# EAGLE schematic Neuro (EAGLE 8.6.0)
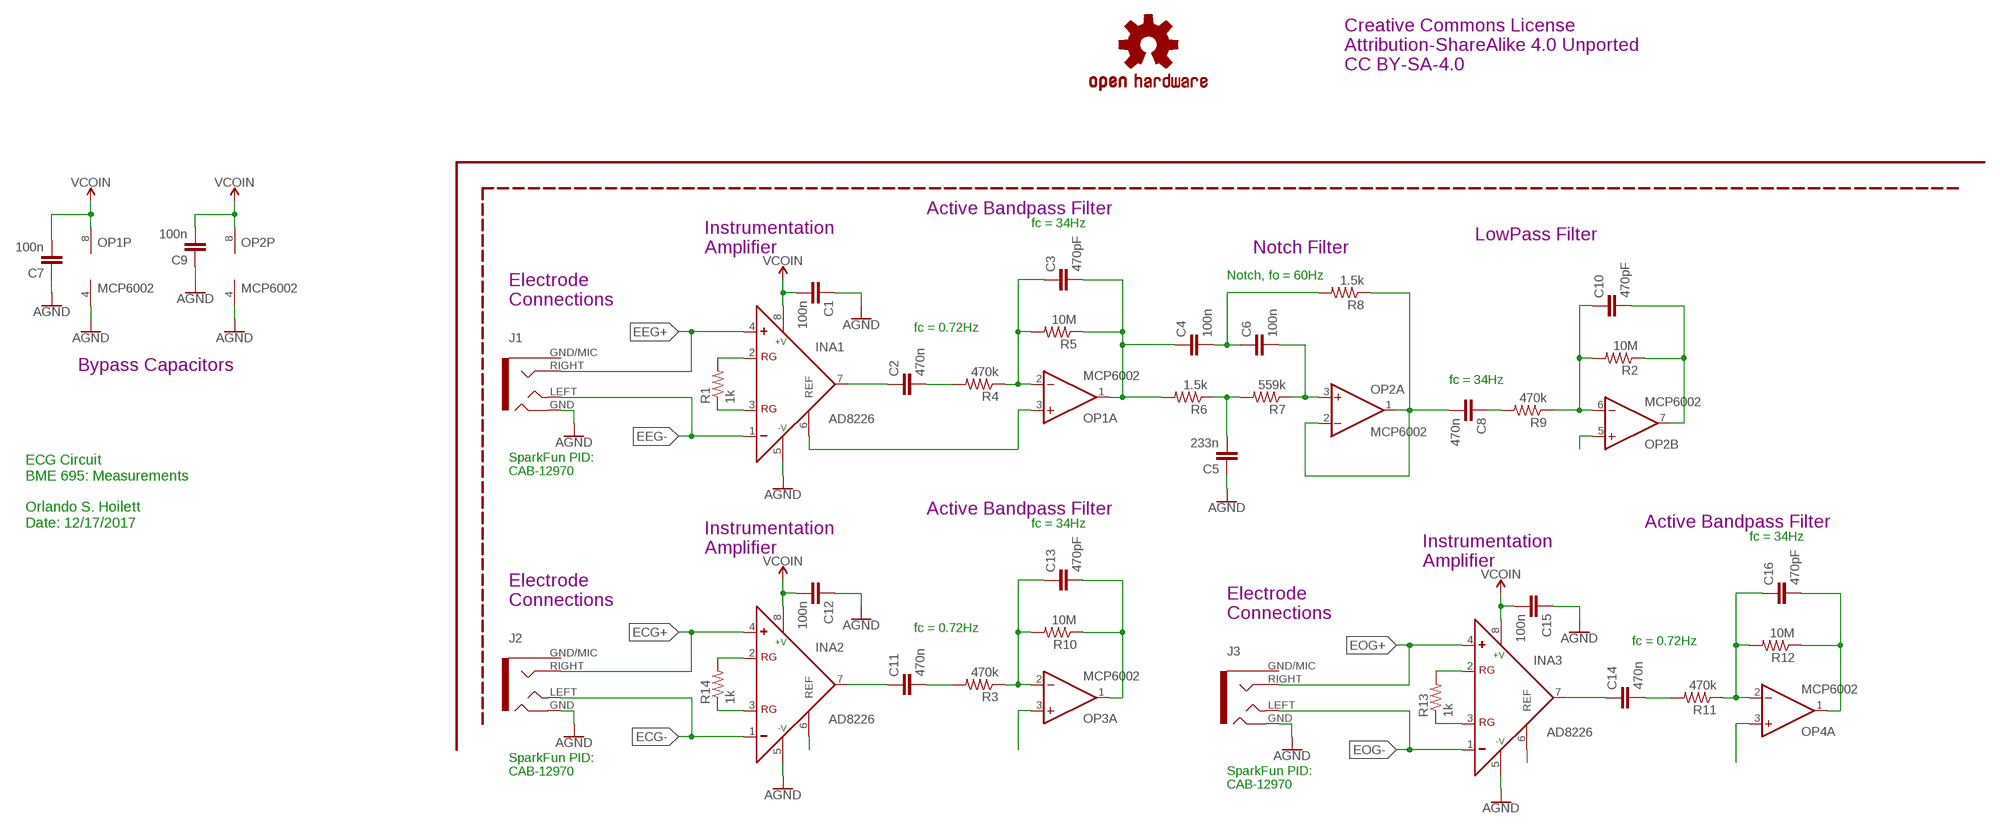
[diagram p0: schematic, sheet 1]

## Parts
C1  100n  CAPACITOR0402  [C0402]
C2  470n  CAPACITOR0402  [C0402]
C3  470pF  CAPACITOR0402  [C0402]
C4  100n  CAPACITOR0402  [C0402]
C5  233n  CAPACITOR0402  [C0402]
C6  100n  CAPACITOR0402  [C0402]
C7  100n  CAPACITOR0402  [C0402]
C8  470n  CAPACITOR0402  [C0402]
C9  100n  CAPACITOR0402  [C0402]
C10  470pF  CAPACITOR0402  [C0402]
C11  470n  CAPACITOR0402  [C0402]
C12  100n  CAPACITOR0402  [C0402]
C13  470pF  CAPACITOR0402  [C0402]
C14  470n  CAPACITOR0402  [C0402]
C15  100n  CAPACITOR0402  [C0402]
C16  470pF  CAPACITOR0402  [C0402]
INA1  AD8226  INA-A  [MSOP08]
INA2  AD8226  INA-A  [MSOP08]
INA3  AD8226  INA-A  [MSOP08]
J1  AUDIO_JACK_TRRSSMD_RA  [AUDIO_JACK_3.5MM_TRRS_SMD_RA]
J2  AUDIO_JACK_TRRSSMD_RA  [AUDIO_JACK_3.5MM_TRRS_SMD_RA]
J3  AUDIO_JACK_TRRSSMD_RA  [AUDIO_JACK_3.5MM_TRRS_SMD_RA]
LOGO1  OSHW-LOGOS  [OSHW-LOGO-S]
OP1  MCP6002  OP-DUALRM  [MSOP08]
OP2  MCP6002  OP-DUALRM  [MSOP08]
OP3  MCP6002  OP-DUALRM  [MSOP08]
OP4  MCP6002  OP-DUALRM  [MSOP08]
R1  1k  RESISTOR0402  [R0402]
R2  10M  RESISTOR0402  [R0402]
R3  470k  RESISTOR0402  [R0402]
R4  470k  RESISTOR0402  [R0402]
R5  10M  RESISTOR0402  [R0402]
R6  1.5k  RESISTOR0402  [R0402]
R7  559k  RESISTOR0402  [R0402]
R8  1.5k  RESISTOR0402  [R0402]
R9  470k  RESISTOR0402  [R0402]
R10  10M  RESISTOR0402  [R0402]
R11  470k  RESISTOR0402  [R0402]
R12  10M  RESISTOR0402  [R0402]
R13  1k  RESISTOR0402  [R0402]
R14  1k  RESISTOR0402  [R0402]

## Nets
AGND: C1.1 C5.1 C7.1 C9.1 C12.1 C15.1 INA1.5(-V) INA2.5(-V) INA3.5(-V) J1.GND(RING2) J2.GND(RING2) J3.GND(RING2) OP1.4(P:V-) OP2.4(P:V-)
ECG+: INA2.4(IN+) J2.RIGHT(RING1)
ECG-: INA2.1(IN-) J2.LEFT(TIP)
EEG+: INA1.4(IN+) J1.RIGHT(RING1)
EEG-: INA1.1(IN-) J1.LEFT(TIP)
EOG+: INA3.4(IN+) J3.RIGHT(RING1)
EOG-: INA3.1(IN-) J3.LEFT(TIP)
INA: C2.1 INA1.7(OUT)
INA1: C11.1 INA2.7(OUT)
INA2: C14.1 INA3.7(OUT)
N$1: C6.2 OP2.3(A:+IN) R7.1
N$2: C5.2 R6.1 R7.2
N$3: C10.1 OP2.6(B:-IN) R2.2 R9.1
N$4: C2.2 R4.2
N$5: C3.1 OP1.2(A:-IN) R4.1 R5.2
N$6: C8.1 R9.2
N$7: C14.2 R11.2
N$8: C4.2 C6.1 R8.2
N$9: C8.2 OP2.1(A:OUT) OP2.2(A:-IN) R8.1
N$10: INA1.2(RG) R1.2
N$11: INA1.3(RG) R1.1
N$12: C16.1 OP4.2(A:-IN) R11.1 R12.2
N$13: C10.2 OP2.7(B:OUT) R2.1
N$14: INA3.2(RG) R13.2
N$15: INA3.3(RG) R13.1
N$16: OP2.5(B:+IN)
N$17: C11.2 R3.2
N$18: C13.1 OP3.2(A:-IN) R3.1 R10.2
N$19: INA2.6(REF)
N$20: INA3.6(REF)
N$23: INA2.2(RG) R14.2
N$24: INA2.3(RG) R14.1
OUT: C3.2 C4.1 OP1.1(A:OUT) R5.1 R6.2
OUT1: C13.2 OP3.1(A:OUT) R10.1
OUT2: C16.2 OP4.1(A:OUT) R12.1
V_BATT: C1.2 C7.2 C9.2 C12.2 C15.2 INA1.8(+V) INA2.8(+V) INA3.8(+V) OP1.8(P:V+) OP2.8(P:V+) ; supply symbol labelled VCOIN
VREF: INA1.6(REF) OP1.3(A:+IN)
VREF1: OP3.3(A:+IN)
VREF2: OP4.3(A:+IN)
Unconnected: J1.GND/MIC(SLEEVE) J2.GND/MIC(SLEEVE) J3.GND/MIC(SLEEVE) OP1.5(B:+IN) OP1.6(B:-IN) OP1.7(B:OUT) OP3.5(B:+IN) OP3.6(B:-IN) OP3.7(B:OUT) OP4.5(B:+IN) OP4.6(B:-IN) OP4.7(B:OUT)

## Notes on the sheet
- Creative Commons License
  Attribution-ShareAlike 4.0 Unported
  CC BY-SA-4.0
- Active Bandpass Filter
- fc = 34Hz
- LowPass Filter
- Instrumentation
  Amplifier
- Notch Filter
- Notch, fo = 60Hz
- Electrode
  Connections
- fc = 0.72Hz
- Bypass Capacitors
- fc = 34Hz
- SparkFun PID:
  CAB-12970
- Active Bandpass Filter
- ECG Circuit
  BME 695: Measurements
  
  Orlando S. Hoilett
  Date: 12/17/2017
- fc = 34Hz | Active Bandpass Filter
- fc = 34Hz
- Instrumentation
  Amplifier
- Instrumentation
  Amplifier
- Electrode
  Connections
- Electrode
  Connections
- fc = 0.72Hz
- fc = 0.72Hz
- SparkFun PID:
  CAB-12970
- SparkFun PID:
  CAB-12970

## Power pins joined to a net without a drawn wire
V+: OP3.8(P:V+) OP4.8(P:V+)
V-: OP3.4(P:V-) OP4.4(P:V-)

## Library data of the parts
C1-C16 = CalvEngIO-Passives:CAPACITOR
INA1-INA3 = CalvEngIO-AnalogIC:INA-A: Generic symbol and footprint for single supply instrumentation amplifier Fits AD8220, AD8226, AD8227, and others Source: http://www.analog.com/media/en/technical-documentation/data-sheets/AD8227.pdf
J1-J3 = CalvEngIO-Connectors:AUDIO_JACK_TRRS: Audio Jack - 3.5mm TRRS (SMD) This is a 3.5mm TRRS SMD audio jack. TRRS connectors are the audio-style connectors that you see on some phones, MP3 players and development boards. TRRS stands for “tip, ring, ring, sleeve,” which reflects that this has three conductors and a ground. SparkFun Products: Audio Jack <https://www.sparkfun.com/products/12639> mbed Starter Kit <https://www.sparkfun.com/products/12968> SparkFun TRRS 3.5mm Jack Breakout <https://www.sparkfun.com/products/11570>; PROD_ID: CONN-10676; SF_ID: PRT-12639
LOGO1 = SparkFun-Aesthetics:OSHW-LOGO: Open-Source Hardware (OSHW) Logo This logo indicates the piece of hardware it is found on incorporates a OSHW license and/or adheres to the definition of open source hardware found here: http://freedomdefined.org/OSHW
OP1-OP4 = CalvEngIO-AnalogIC:OP-DUAL: Precision Micropower, Low Noise CMOS, Rail-to-Rail Input/Output Operational Amplifiers Source: http://www.analog.com/static/imported-files/data_sheets/AD8603_8607_8609.pdf; MF: ALTERA CORPORATION; MPN: AD8607ARMZ-REEL; OC_FARNELL: 1464990; OC_NEWARK: 59K6925
R1-R14 = CalvEngIO-Passives:RESISTOR